# Altium schematic sheet iotv2.SchDoc
size A
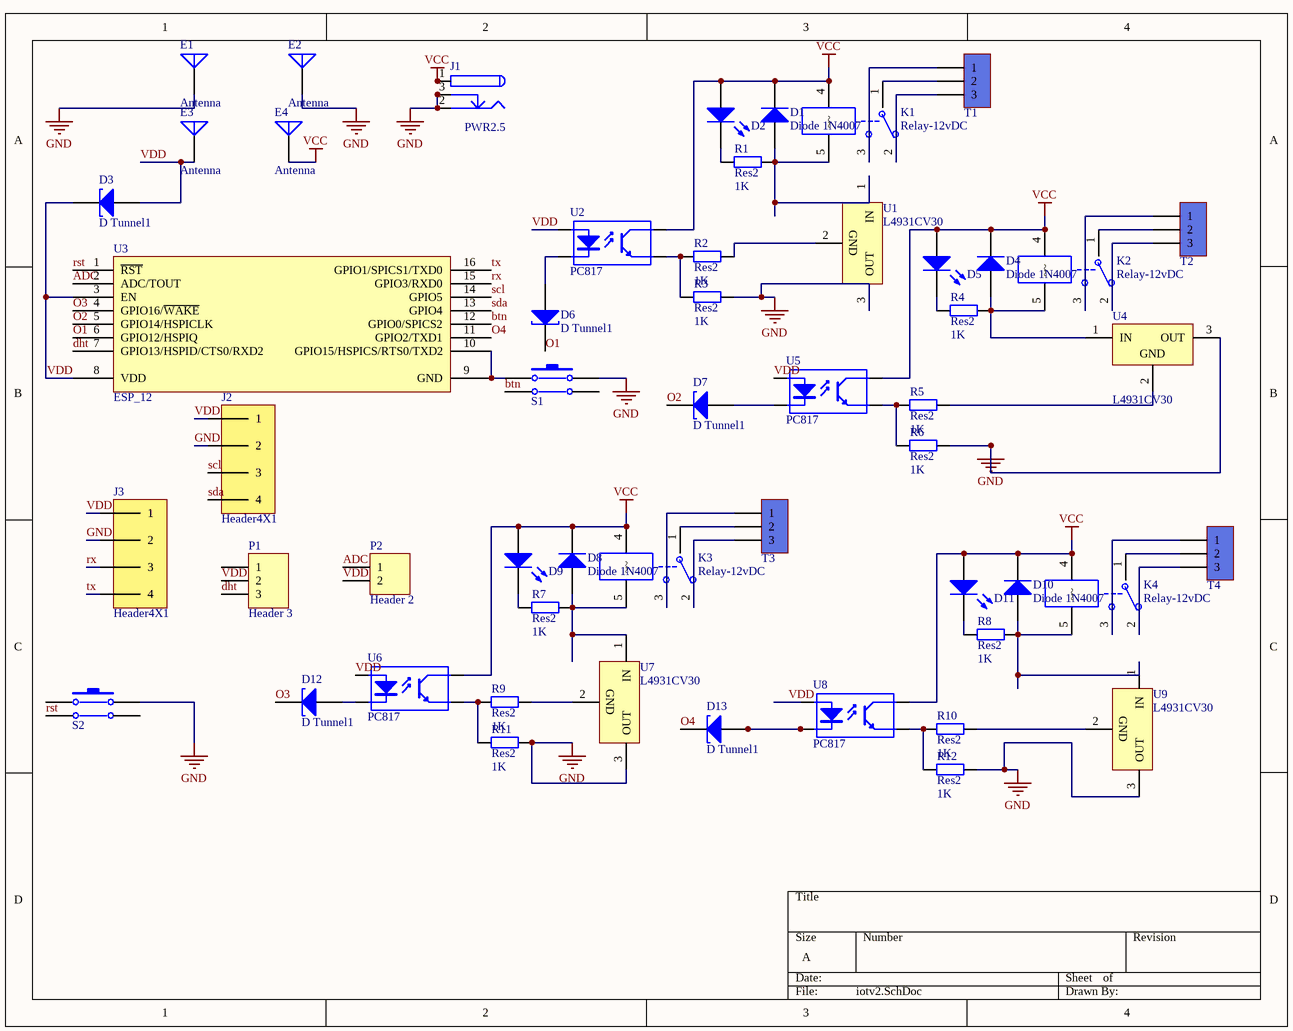
[diagram p0: iotv2.SchDoc]

## Parts
D1  Diode 1N4007  [DO-41]
D2  LED 3mm  [LED-3mm]  (value not drawn)
D3  D Tunnel1  [3.2X1.6X1.1]
D4  Diode 1N4007  [DO-41]
D5  LED 3mm  [LED-3mm]  (value not drawn)
D6  D Tunnel1  [3.2X1.6X1.1]
D7  D Tunnel1  [3.2X1.6X1.1]
D8  Diode 1N4007  [DO-41]
D9  LED 3mm  [LED-3mm]  (value not drawn)
D10  Diode 1N4007  [DO-41]
D11  LED 3mm  [LED-3mm]  (value not drawn)
D12  D Tunnel1  [3.2X1.6X1.1]
D13  D Tunnel1  [3.2X1.6X1.1]
E1  Antenna  [PIN1]
E2  Antenna  [PIN1]
E3  Antenna  [PIN1]
E4  Antenna  [PIN1]
J1  PWR2.5  [KLD-0202]
J2  Header4X1  [HEADER 4X1]
J3  Header4X1  [HEADER 4X1]
K1  Relay-12vDC  [Relays]
K2  Relay-12vDC  [Relays]
K3  Relay-12vDC  [Relays]
K4  Relay-12vDC  [Relays]
P1  Header 3  [HDR1X3]
P2  Header 2  [HDR1X2]
R1  Res2  value 1K  [AXIAL-0.4]
R2  Res2  value 1K  [AXIAL-0.4]
R3  Res2  value 1K  [AXIAL-0.4]
R4  Res2  value 1K  [AXIAL-0.4]
R5  Res2  value 1K  [AXIAL-0.4]
R6  Res2  value 1K  [AXIAL-0.4]
R7  Res2  value 1K  [AXIAL-0.4]
R8  Res2  value 1K  [AXIAL-0.4]
R9  Res2  value 1K  [AXIAL-0.4]
R10  Res2  value 1K  [AXIAL-0.4]
R11  Res2  value 1K  [AXIAL-0.4]
R12  Res2  value 1K  [AXIAL-0.4]
S1  PUSH BUTTON DOUBLE  [PUSH BUTTON]  (value not drawn)
S2  PUSH BUTTON DOUBLE  [PUSH BUTTON]  (value not drawn)
T1  Terminal  [Terminal 1*3]  (value not drawn)
T2  Terminal  [Terminal 1*3]  (value not drawn)
T3  Terminal  [Terminal 1*3]  (value not drawn)
T4  Terminal  [Terminal 1*3]  (value not drawn)
U1  L4931CV30  [TO-220A]
U2  PC817  [DIP4]
U3  ESP_12  [ESP_12]
U4  L4931CV30  [TO-220A]
U5  PC817  [DIP4]
U6  PC817  [DIP4]
U7  L4931CV30  [TO-220A]
U8  PC817  [DIP4]
U9  L4931CV30  [TO-220A]

## Nets
GND: E1.1(A) E2.1(A) J1.2 J1.2A J1.2B J1.3 J1.3A J1.3B J2.2 J3.2 R3.2 R6.2 R11.2 R12.2 S1.2 S2.2 U1.3(OUT) U4.3(OUT) U7.3(OUT) U9.3(OUT)
VCC: D1.2(K) D2.1(A) D4.2(K) D5.1(A) D8.2(K) D9.1(A) D10.2(K) D11.1(A) E4.1(A) J1.1 J1.1A J1.1B K1.4 K2.4 K3.4 K4.4 U2.4(C) U5.4(C) U6.4(C) U8.4(C)
ADC: P2.1 U3.2(ADC/TOUT)
btn: S1.3 U3.12(GPIO0/SPICS2)
dht: P1.3 U3.7(GPIO13/HSPID/CTS0/RXD2)
O1: D6.2(K) U3.6(GPIO12/HSPIQ)
O2: D7.2(K) U3.5(GPIO14/HSPICLK)
O3: D12.2(K) U3.4(GPIO16/~{WAKE})
O4: D13.2(K) U3.11(GPIO2/TXD1)
rst: S2.3 U3.1(~{RST})
rx: J3.3 U3.15(GPIO3/RXD0)
scl: J2.3 U3.14(GPIO5)
sda: J2.4 U3.13(GPIO4)
tx: J3.4 U3.16(GPIO1/SPICS1/TXD0)
VDD: D3.1(A) D3.2(K) E3.1(A) J2.1 J3.1 P1.2 P2.2 U2.1(A) U3.3(EN) U3.8(VDD) U5.1(A) U6.1(A) U8.1(A)
NetD1_1: D1.1(A) K1.5 R1.2 U1.1(IN)
NetD2_2: D2.2(K) R1.1
NetD4_1: D4.1(A) K2.5 R4.2 U4.1(IN)
NetD5_2: D5.2(K) R4.1
NetD6_1: D6.1(A) U2.2(K)
NetD7_1: D7.1(A) U5.2(K)
NetD8_1: D8.1(A) K3.5 R7.2 U7.1(IN)
NetD9_2: D9.2(K) R7.1
NetD10_1: D10.1(A) K4.5 R8.2 U9.1(IN)
NetD11_2: D11.2(K) R8.1
NetD12_1: D12.1(A) U6.2(K)
NetD13_1: D13.1(A) U8.2(K)
NetK1_1: K1.1(COM) T1.2
NetK1_2: K1.2(NC) T1.3
NetK1_3: K1.3(NO) T1.1
NetK2_1: K2.1(COM) T2.2
NetK2_2: K2.2(NC) T2.3
NetK2_3: K2.3(NO) T2.1
NetK3_1: K3.1(COM) T3.2
NetK3_2: K3.2(NC) T3.3
NetK3_3: K3.3(NO) T3.1
NetK4_1: K4.1(COM) T4.2
NetK4_2: K4.2(NC) T4.3
NetK4_3: K4.3(NO) T4.1
NetR2_1: R2.1 R3.1 U2.3(E)
NetR2_2: R2.2 U1.2(GND)
NetR5_1: R5.1 R6.1 U5.3(E)
NetR5_2: R5.2 U4.2(GND)
NetR9_1: R9.1 R11.1 U6.3(E)
NetR9_2: R9.2 U7.2(GND)
NetR10_1: R10.1 R12.1 U8.3(E)
NetR10_2: R10.2 U9.2(GND)
NetS1_1: S1.1 U3.9(GND) U3.10(GPIO15/HSPICS/RTS0/TXD2)

Not connected (* = marked no-connect by the designer): P1 1; S1 4; S2 1 4

## Library data of the parts
D1 D4 D8 D10 = Diode 1N4007: 1 Amp General Purpose Rectifier; Published: 8-Jun-2000; LatestRevisionDate: 17-Jul-2002; LatestRevisionNote: Re-released for DXP Platform.; DatasheetVersion: 1998; PackageVersion: Aug-1999; PackageReference: DO-41; Publisher: Altium Limited; PackageDescription: Diode, Axial; Body 5.2 x 2.7 mm (LxDia. max), Lead Dia. 0.86 mm (max); Code_JEDEC: DO-204-AL; ComponentLink1Description: Manufacturer Link; ComponentLink1URL: http://www.fairchildsemi.com/; ComponentLink2Description: Datasheet; ComponentLink2URL: http://www.fairchildsemi.com/ds/1N%2F1N4001.pdf
D2 D5 D9 D11 = LED 3mm: Typical LED; Designer: Seyed Mohsen Ghasemian; Published: 02/04/2012; PackageReference: LED; Publisher: www.picpars.com; PackageDescription: LED; 2 Leads
D3 D6 D7 D12 D13 = D Tunnel1: Tunnel Diode - RLC Model; Published: 8-Jun-2000; LatestRevisionDate: 17-Jul-2002; LatestRevisionNote: Re-released for DXP Platform.; PackageVersion: Feb-2002; PackageReference: 3.2X1.6X1.1; Publisher: Altium Limited; PackageDescription: SM LED; 2 Flat Leads
E1-E4 = Antenna: Generic Antenna; Published: 24-Mar-1999; LatestRevisionDate: 17-Jul-2002; LatestRevisionNote: Re-released for DXP Platform.; PackageReference: PIN1; Publisher: Altium Limited
J1 = PWR2.5: Low Voltage Power Supply Connector; Published: 17-Dec-2003; DatasheetDocument: 09-May-2002; Publisher: Altium Limited; ComponentLink1Description: Manufacturer Link; ComponentLink1URL: http://domino.kycon.com/internet/Products.html
K1-K4 = Relay-05vDC: Relay-05vDC-240AC 5A; Designer: Seyed Mohsen Ghasemain; ComponentLinkURL: www.picpars.com
P1 = Header 3: Header, 3-Pin; LatestRevisionDate: 17-Jul-2002; LatestRevisionNote: Re-released for DXP Platform.; Publisher: Altium Limited
P2 = Header 2: Header, 2-Pin; LatestRevisionDate: 17-Jul-2002; LatestRevisionNote: Re-released for DXP Platform.; Publisher: Altium Limited
R1-R12 = Res2: Resistor; Published: 8-Jun-2000; LatestRevisionDate: 17-Jul-2002; LatestRevisionNote: Re-released for DXP Platform.; PackageReference: AXIAL-0.4; Publisher: Altium Limited; PackageDescription: Axial Device, Thru-Hole; 2 Leads; 0.4 in Pin Spacing
S1 S2 = PUSH BUTTON DOUBLE: Switch
T1-T4 = Terminal 1*3: Terminal 3 Pin 250VAC 16A; Designer: Seyed Mohsen Ghasemain; E-mail: picpars@gmail.com; ComponentLinkURL: www.picpars.com
U1 U4 U7 U9 = L4931CV30: 250mA, Very Low Drop ( 0.4V) Voltage Regulator; Published: 24-Aug-2001; LatestRevisionDate: 06-Jun-2005; LatestRevisionNote: PCB Pin sequence re-ordered.; DatasheetVersion: Apr-1999; PackageVersion: Jul-2004; PackageReference: TO-220A; Publisher: Altium Limited; PackageDescription: TO, Thru-Hole, Vertical, Heatsink Mounted; 3 In-Line Leads; Pitch 2.54 mm; ComponentLink1Description: Manufacturer Link; ComponentLink1URL: http://www.st.com/; ComponentLink2Description: Datasheet; ComponentLink2URL: http://www.st.com/stonline/products/literature/ds/4340/l4931abxx15.pdf
U2 U5 U6 U8 = OPTCOUPLER_01: 4-Pin Phototransistor Optocoupler
U3 = ESP_12: ESP-12 Wi-Fi Module by AI-Thinker; IC: ESP8266-EX; Vendor: Ai-thinker